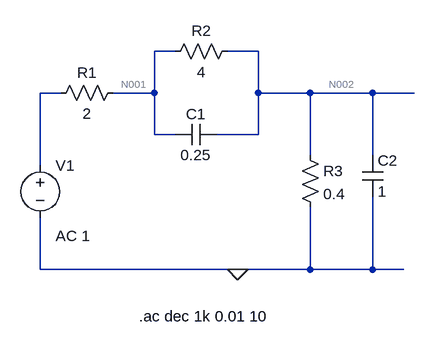
[diagram p0: schematic TS12_2_YRC.asc]
TS12_2_YRC.asc, the LTspice schematic file:
Version 4
SHEET 1 880 680
WIRE 208 32 176 32
WIRE 336 32 288 32
WIRE 32 96 0 96
WIRE 176 96 176 32
WIRE 176 96 112 96
WIRE 336 96 336 32
WIRE 416 96 336 96
WIRE 512 96 416 96
WIRE 576 96 512 96
WIRE 176 160 176 96
WIRE 208 160 176 160
WIRE 336 160 336 96
WIRE 336 160 272 160
WIRE 416 192 416 96
WIRE 512 192 512 96
WIRE 0 208 0 96
WIRE 0 368 0 288
WIRE 304 368 0 368
WIRE 416 368 416 272
WIRE 416 368 304 368
WIRE 512 368 512 256
WIRE 512 368 416 368
WIRE 560 368 512 368
FLAG 304 368 0
SYMBOL res 128 80 R90
WINDOW 0 0 56 VBottom 2
WINDOW 3 32 56 VTop 2
SYMATTR InstName R1
SYMATTR Value 2
SYMBOL res 304 16 R90
WINDOW 0 0 56 VBottom 2
WINDOW 3 32 56 VTop 2
SYMATTR InstName R2
SYMATTR Value 4
SYMBOL cap 272 144 R90
WINDOW 0 0 32 VBottom 2
WINDOW 3 32 32 VTop 2
SYMATTR InstName C1
SYMATTR Value 0.25
SYMBOL res 400 176 R0
SYMATTR InstName R3
SYMATTR Value 0.4
SYMBOL cap 496 192 R0
SYMATTR InstName C2
SYMATTR Value 1
SYMBOL voltage 0 192 R0
WINDOW 123 24 124 Left 2
WINDOW 39 0 0 Left 0
SYMATTR InstName V1
SYMATTR Value ""
SYMATTR Value2 AC 1
TEXT 152 440 Left 2 !.ac dec 1k 0.01 10

The netlist it stands for:
* TS12_2_YRC.asc
R1 N001 N003 2
R2 N002 N001 4
C1 N002 N001 0.25
R3 N002 0 0.4
C2 N002 0 1
V1 N003 0 AC 1
.ac dec 1k 0.01 10
.backanno
.end

* Results of the author's LTspice run, read from the files saved beside the schematic
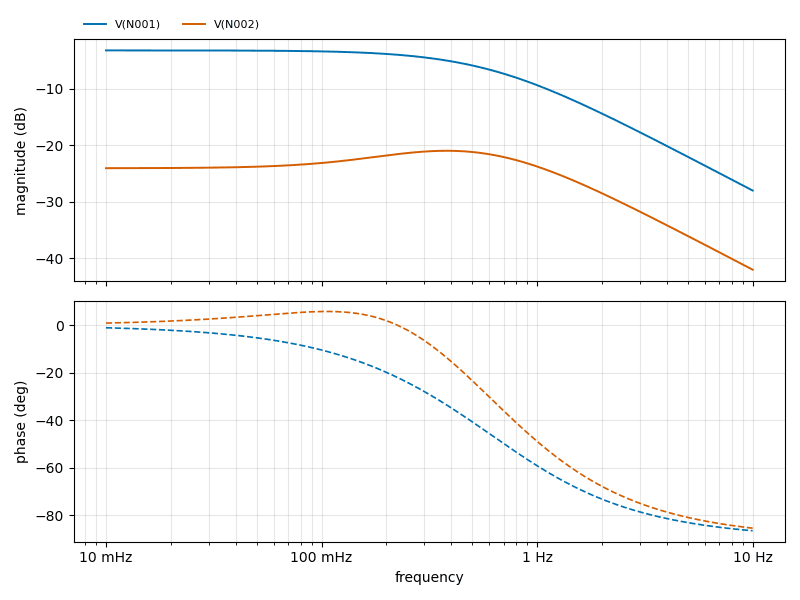
[diagram p1: AC Analysis of TS12_2_YRC.asc, plotted from the saved traces]
* AC Analysis, 1 run:
*   V(N001): -3.26 dB at 10 mHz, -28.02 dB at 10 Hz, peak -3.26 dB at 10 mHz, 3 dB below the peak at 548.1 mHz
*   V(N002): -24.07 dB at 10 mHz, -42.01 dB at 10 Hz, peak -20.99 dB at 380.2 mHz, 3 dB below the peak at 26.28 mHz and 1.041 Hz